# Altium schematic sheet MCU.SchDoc
size B; DrawnBy: Duc Huy Le; SheetNumber: 3; SheetTotal: 4
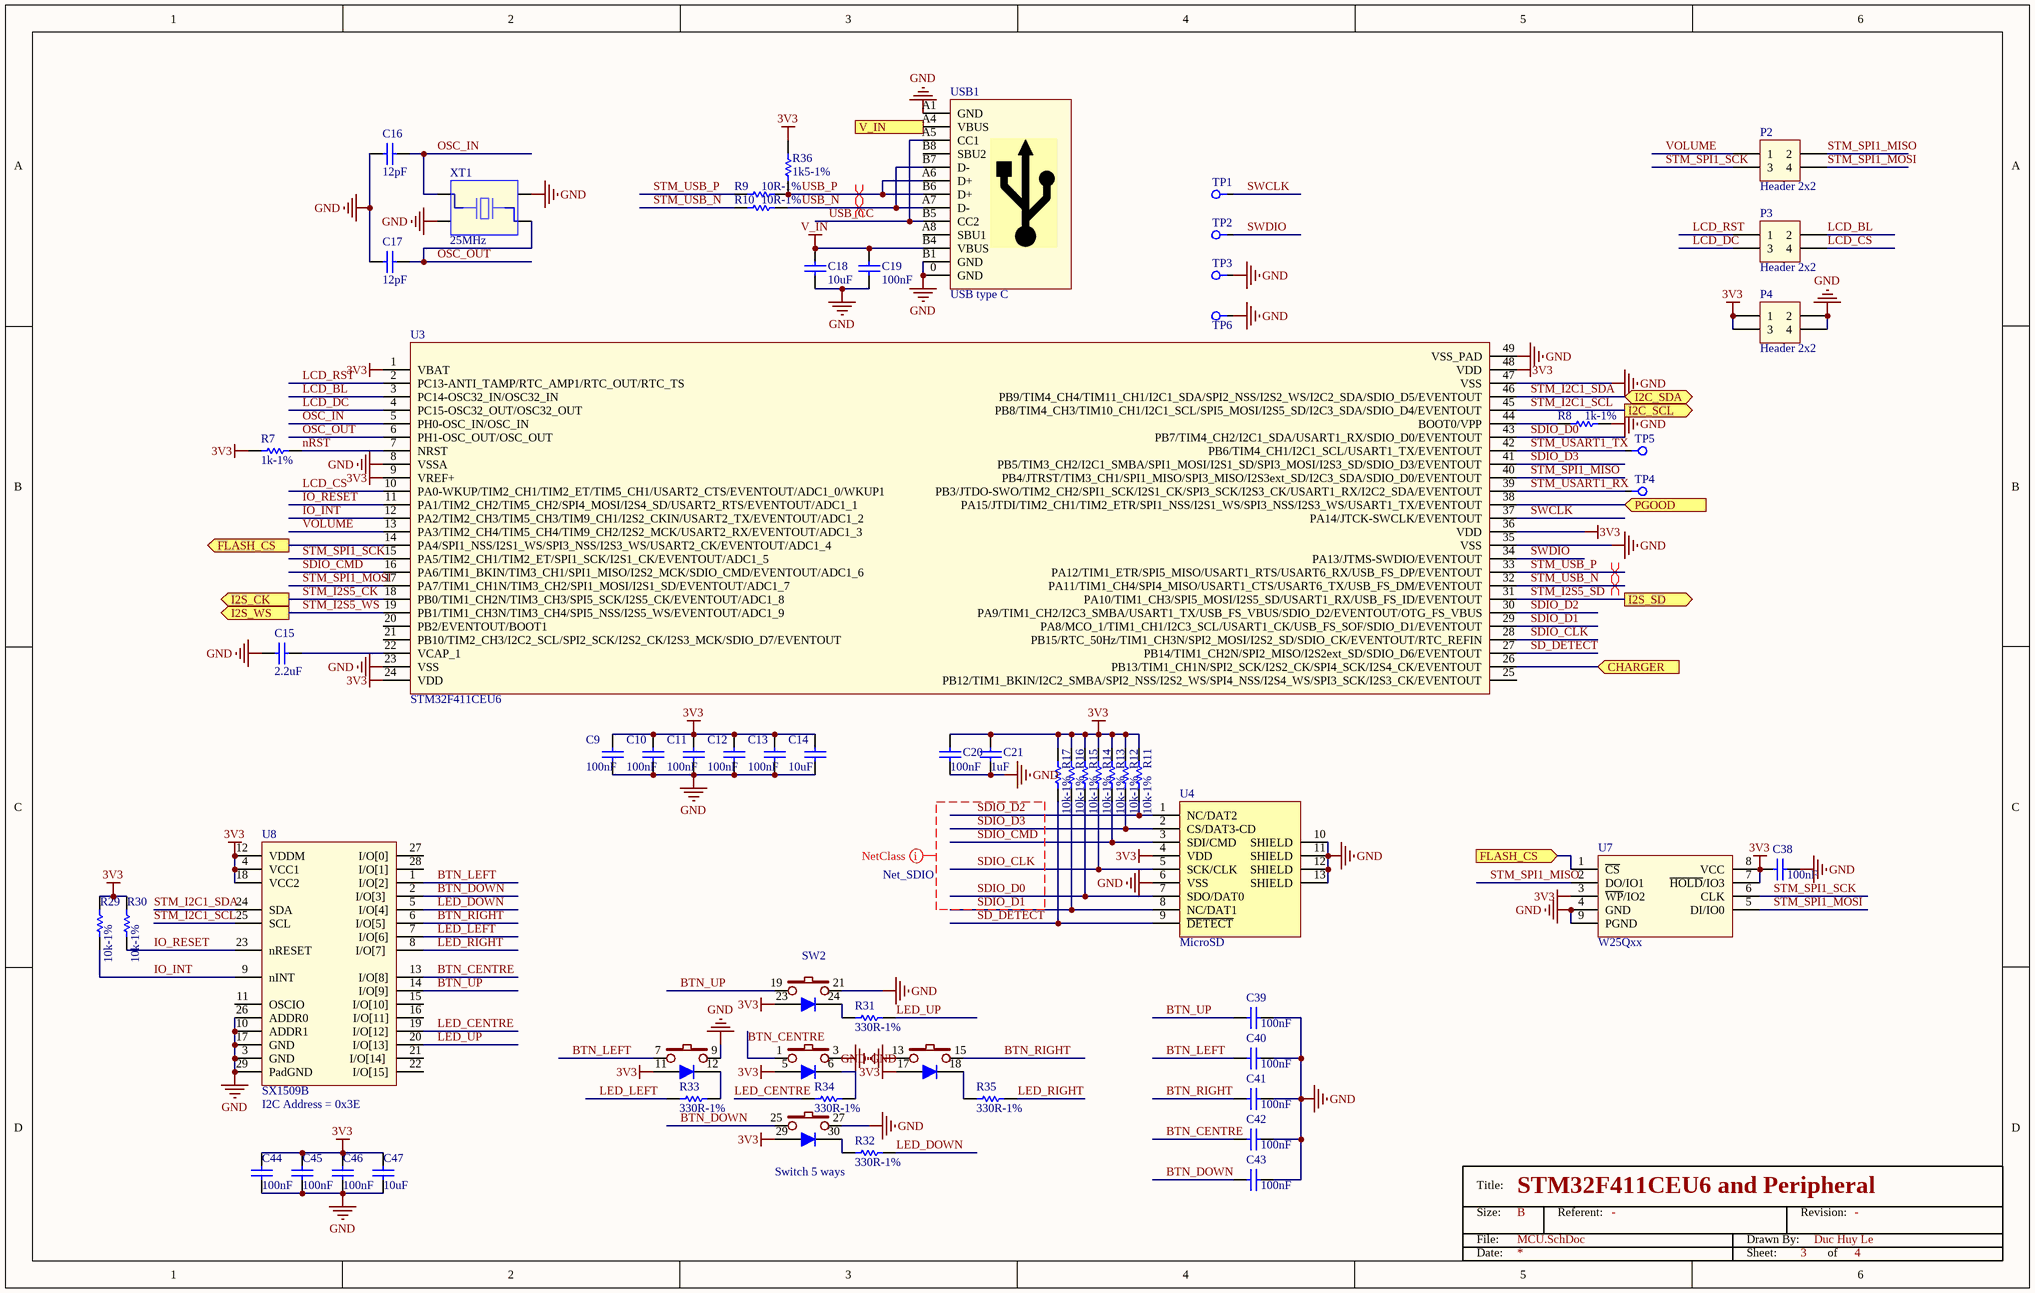
[diagram p0: MCU.SchDoc]

## Parts
C9  100nF  [Cap 0603]
C10  100nF  [Cap 0603]
C11  100nF  [Cap 0603]
C12  100nF  [Cap 0603]
C13  100nF  [Cap 0603]
C14  10uF  [Cap 0603]
C15  2.2uF  [Cap 0603]
C16  12pF  [Cap 0603]
C17  12pF  [Cap 0603]
C18  10uF  [Cap 0603]
C19  100nF  [Cap 0603]
C20  100nF  [Cap 0603]
C21  1uF  [Cap 0603]
C38  100nF  [Cap 0603]
C39  100nF  [Cap 0603]
C40  100nF  [Cap 0603]
C41  100nF  [Cap 0603]
C42  100nF  [Cap 0603]
C43  100nF  [Cap 0603]
C44  100nF  [Cap 0603]
C45  100nF  [Cap 0603]
C46  100nF  [Cap 0603]
C47  10uF  [Cap 0603]
P2  Header 2x2  [Header 2mm 2x2]
P3  Header 2x2  [Header 2mm 2x2]
P4  Header 2x2  [Header 2mm 2x2]
R7  1k-1%  [Res 0603]
R8  1k-1%  [Res 0603]
R9  10R-1%  [Res 0603]
R10  10R-1%  [Res 0603]
R11  10k-1%  [Res 0603]
R12  10k-1%  [Res 0603]
R13  10k-1%  [Res 0603]
R14  10k-1%  [Res 0603]
R15  10k-1%  [Res 0603]
R16  10k-1%  [Res 0603]
R17  10k-1%  [Res 0603]
R29  10k-1%  [Res 0603]
R30  10k-1%  [Res 0603]
R31  330R-1%  [Res 0603]
R32  330R-1%  [Res 0603]
R33  330R-1%  [Res 0603]
R34  330R-1%  [Res 0603]
R35  330R-1%  [Res 0603]
R36  1k5-1%  [Res 0603]
SW2  Switch 5 ways  [Switch 5 ways]
TitleBlock3  Title: STM32F411CEU6 and Peripheral  Size: B  (hidden comment: Title Block)
TP1  TP  [TP]  (value not drawn)
TP2  TP  [TP]  (value not drawn)
TP3  TP  [TP]  (value not drawn)
TP4  TP  [TP]  (value not drawn)
TP5  TP  [TP]  (value not drawn)
TP6  TP  [TP]  (value not drawn)
U3  STM32F411CEU6  [UFQFPN-48]
U4  MicroSD  [MicroSD A]
U7  W25Qxx  [WSON 6x5]
U8  SX1509B  [QFN-28 4x4]
USB1  USB type C  [USB Type C]
XT1  25MHz  [Crystal 3225]

## Ports
CHARGER (in), FLASH_CS (in), FLASH_CS (out), I2C_SCL (out), I2C_SDA (bidir), I2S_CK (out), I2S_SD (out), I2S_WS (out), PGOOD (in), V_IN (out)

## Nets
3V3: C9.2 C10.2 C11.2 C12.2 C13.2 C14.2 C20.1 C21.1 C38.2 C44.2 C45.2 C46.2 C47.2 P4.1 P4.3 R7.2 R11.1 R12.1 R13.1 R14.1 R15.1 R16.1 R17.1 R29.1 R30.1 R36.2 SW2.5(A) SW2.11(A) SW2.17(A) SW2.23(A) SW2.29(A) U3.1(VBAT) U3.9(VREF+) U3.24(VDD) U3.36(VDD) U3.48(VDD) U4.4(VDD) U7.3(~{WP}/IO2) U7.7(~{HOLD}/IO3) U7.8(VCC) U8.4(VCC1) U8.12(VDDM) U8.18(VCC2)
GND: C9.1 C10.1 C11.1 C12.1 C13.1 C14.1 C15.2 C16.2 C17.2 C18.2 C19.2 C20.2 C21.2 C38.1 C39.1 C40.1 C41.1 C42.1 C43.1 C44.1 C45.1 C46.1 C47.1 P4.2 P4.4 R8.1 SW2.3 SW2.9 SW2.13 SW2.21 SW2.27 TP3.1 TP6.1 U3.8(VSSA) U3.23(VSS) U3.35(VSS) U3.47(VSS) U3.49(VSS_PAD) U4.6(VSS) U4.10(SHIELD) U4.11(SHIELD) U4.12(SHIELD) U4.13(SHIELD) U7.4(GND) U7.9(PGND) U8.3(GND) U8.10(ADDR1) U8.17(GND) U8.26(ADDR0) U8.29(PadGND) USB1.0(GND) USB1.A1(GND) USB1.B1(GND) XT1.2 XT1.4
V_IN: C18.1 C19.1 USB1.B4(VBUS)
BTN_CENTRE: C42.2 SW2.1 U8.13(I/O[8])
BTN_DOWN: C43.2 SW2.25 U8.2(I/O[3])
BTN_LEFT: C40.2 SW2.7 U8.1(I/O[2])
BTN_RIGHT: C41.2 SW2.15 U8.6(I/O[5])
BTN_UP: C39.2 SW2.19 U8.14(I/O[9])
CHARGER: U3.26(PB13/TIM1_CH1N/SPI2_SCK/I2S2_CK/SPI4_SCK/I2S4_CK/EVENTOUT) ; port CHARGER
FLASH_CS: U3.14(PA4/SPI1_NSS/I2S1_WS/SPI3_NSS/I2S3_WS/USART2_CK/EVENTOUT/ADC1_4) U7.1(~{CS}) ; port FLASH_CS
IO_INT: R29.2 U3.12(PA2/TIM2_CH3/TIM5_CH3/TIM9_CH1/I2S2_CKIN/USART2_TX/EVENTOUT/ADC1_2) U8.9(nINT)
IO_RESET: R30.2 U3.11(PA1/TIM2_CH2/TIM5_CH2/SPI4_MOSI/I2S4_SD/USART2_RTS/EVENTOUT/ADC1_1) U8.23(nRESET)
LCD_BL: P3.2 U3.3(PC14-OSC32_IN/OSC32_IN)
LCD_CS: P3.4 U3.10(PA0-WKUP/TIM2_CH1/TIM2_ET/TIM5_CH1/USART2_CTS/EVENTOUT/ADC1_0/WKUP1)
LCD_DC: P3.3 U3.4(PC15-OSC32_OUT/OSC32_OUT)
LCD_RST: P3.1 U3.2(PC13-ANTI_TAMP/RTC_AMP1/RTC_OUT/RTC_TS)
LED_CENTRE: R34.1 U8.19(I/O[12])
LED_DOWN: R32.2 U8.5(I/O[4])
LED_LEFT: R33.1 U8.7(I/O[6])
LED_RIGHT: R35.2 U8.8(I/O[7])
LED_UP: R31.2 U8.20(I/O[13])
nRST: R7.1 U3.7(NRST)
OSC_IN: C16.1 U3.5(PH0-OSC_IN/OSC_IN) XT1.1
OSC_OUT: C17.1 U3.6(PH1-OSC_OUT/OSC_OUT) XT1.3
PGOOD: U3.38(PA15/JTDI/TIM2_CH1/TIM2_ETR/SPI1_NSS/I2S1_WS/SPI3_NSS/I2S3_WS/USART1_TX/EVENTOUT) ; port PGOOD
SD_DETECT: R17.2 U3.27(PB14/TIM1_CH2N/SPI2_MISO/I2S2ext_SD/SDIO_D6/EVENTOUT) U4.9(~{DETECT})
SDIO_CLK: R14.2 U3.28(PB15/RTC_50Hz/TIM1_CH3N/SPI2_MOSI/I2S2_SD/SDIO_CK/EVENTOUT/RTC_REFIN) U4.5(SCK/CLK)
SDIO_CMD: R13.2 U3.16(PA6/TIM1_BKIN/TIM3_CH1/SPI1_MISO/I2S2_MCK/SDIO_CMD/EVENTOUT/ADC1_6) U4.3(SDI/CMD)
SDIO_D0: R15.2 U3.43(PB7/TIM4_CH2/I2C1_SDA/USART1_RX/SDIO_D0/EVENTOUT) U4.7(SDO/DAT0)
SDIO_D1: R16.2 U3.29(PA8/MCO_1/TIM1_CH1/I2C3_SCL/USART1_CK/USB_FS_SOF/SDIO_D1/EVENTOUT) U4.8(NC/DAT1)
SDIO_D2: R11.2 U3.30(PA9/TIM1_CH2/I2C3_SMBA/USART1_TX/USB_FS_VBUS/SDIO_D2/EVENTOUT/OTG_FS_VBUS) U4.1(NC/DAT2)
SDIO_D3: R12.2 U3.41(PB5/TIM3_CH2/I2C1_SMBA/SPI1_MOSI/I2S1_SD/SPI3_MOSI/I2S3_SD/SDIO_D3/EVENTOUT) U4.2(CS/DAT3-CD)
STM_I2C1_SCL: U3.45(PB8/TIM4_CH3/TIM10_CH1/I2C1_SCL/SPI5_MOSI/I2S5_SD/I2C3_SDA/SDIO_D4/EVENTOUT) U8.25(SCL) ; port I2C_SCL
STM_I2C1_SDA: U3.46(PB9/TIM4_CH4/TIM11_CH1/I2C1_SDA/SPI2_NSS/I2S2_WS/I2C2_SDA/SDIO_D5/EVENTOUT) U8.24(SDA) ; port I2C_SDA
STM_I2S5_CK: U3.18(PB0/TIM1_CH2N/TIM3_CH3/SPI5_SCK/I2S5_CK/EVENTOUT/ADC1_8) ; port I2S_CK
STM_I2S5_SD: U3.31(PA10/TIM1_CH3/SPI5_MOSI/I2S5_SD/USART1_RX/USB_FS_ID/EVENTOUT) ; port I2S_SD
STM_I2S5_WS: U3.19(PB1/TIM1_CH3N/TIM3_CH4/SPI5_NSS/I2S5_WS/EVENTOUT/ADC1_9) ; port I2S_WS
STM_SPI1_MISO: P2.2 U3.40(PB4/JTRST/TIM3_CH1/SPI1_MISO/SPI3_MISO/I2S3ext_SD/I2C3_SDA/SDIO_D0/EVENTOUT) U7.2(DO/IO1)
STM_SPI1_MOSI: P2.4 U3.17(PA7/TIM1_CH1N/TIM3_CH2/SPI1_MOSI/I2S1_SD/EVENTOUT/ADC1_7) U7.5(DI/IO0)
STM_SPI1_SCK: P2.3 U3.15(PA5/TIM2_CH1/TIM2_ET/SPI1_SCK/I2S1_CK/EVENTOUT/ADC1_5) U7.6(CLK)
STM_USART1_RX: TP4.1 U3.39(PB3/JTDO-SWO/TIM2_CH2/SPI1_SCK/I2S1_CK/SPI3_SCK/I2S3_CK/USART1_RX/I2C2_SDA/EVENTOUT)
STM_USART1_TX: TP5.1 U3.42(PB6/TIM4_CH1/I2C1_SCL/USART1_TX/EVENTOUT)
STM_USB_N: R10.2 U3.32(PA11/TIM1_CH4/SPI4_MISO/USART1_CTS/USART6_TX/USB_FS_DM/EVENTOUT)
STM_USB_P: R9.2 U3.33(PA12/TIM1_ETR/SPI5_MISO/USART1_RTS/USART6_RX/USB_FS_DP/EVENTOUT)
SWCLK: TP1.1 U3.37(PA14/JTCK-SWCLK/EVENTOUT)
SWDIO: TP2.1 U3.34(PA13/JTMS-SWDIO/EVENTOUT)
USB_CC: USB1.A5(CC1) USB1.B5(CC2)
USB_N: R10.1 USB1.A7(D-) USB1.B7(D-)
USB_P: R9.1 R36.1 USB1.A6(D+) USB1.B6(D+)
V_IN: USB1.A4(VBUS) ; port V_IN  [a separate net that carries the same name]
VOLUME: P2.1 U3.13(PA3/TIM2_CH4/TIM5_CH4/TIM9_CH2/I2S2_MCK/USART2_RX/EVENTOUT/ADC1_3)
NetC15_1: C15.1 U3.22(VCAP_1)
NetR8_2: R8.2 U3.44(BOOT0/VPP)
NetR31_1: R31.1 SW2.24(K)
NetR32_1: R32.1 SW2.30(K)
NetR33_2: R33.2 SW2.12(K)
NetR34_2: R34.2 SW2.6(K)
NetR35_1: R35.1 SW2.18(K)

Not connected (* = marked no-connect by the designer): U3 20(PB2/EVENTOUT/BOOT1) 21(PB10/TIM2_CH3/I2C2_SCL/SPI2_SCK/I2S2_CK/I2S3_MCK/SDIO_D7/EVENTOUT) 25(PB12/TIM1_BKIN/I2C2_SMBA/SPI2_NSS/I2S2_WS/SPI4_NSS/I2S4_WS/SPI3_SCK/I2S3_CK/EVENTOUT); U8 11(OSCIO) 15(I/O[10]) 16(I/O[11]) 21(I/O[14]_) 22(I/O[15]) 27(I/O[0]) 28(I/O[1]); USB1 A8(SBU1) B8(SBU2)

## Layout directives
differential pair; differential pair class Diff_USB: STM_USB_N, STM_USB_P
differential pair: USB_N, USB_P
net class Net_SDIO: SDIO_CLK, SDIO_CMD, SDIO_D0, SDIO_D1, SDIO_D2, SDIO_D3

## Notes on the sheet
- (near U8) I2C Address = 0x3E
- (in symbol Title Block) Title:; Size:; Referent:; Revision:; File:; Drawn By:; Date:; Sheet:; of

## Library data of the parts
C9-C21 C38-C47 = Cap: Cap SMD
R7-R17 R29-R36 = Res: Res SMD
SW2 = Switch 5 ways: Switch 5 ways: left, right, up, down, centre; pin to pad: 1>1+2 3>3+4 7>7+8 9>9+10 13>13+14 15>15+16 19>19+20 21>21+22 25>25+26 27>27+28
U3 = STM32F411CEU6: UFQFPN48 Arm® Cortex®-M4 32b MCU+FPU, 125 DMIPS, 512KB Flash, / 128KB RAM, USB OTG FS, 11 TIMs, 1 ADC, 13 comm. interfaces
U4 = MicroSD-A: MicroSD Push-Push A
U7 = W25Qxx: Flash Memory SPI Interface
U8 = SX1509B: SX1509B 16-channel I2C GPIO with LED Driver and Keypad Engine
USB1 = USB type C: USB type C 16 Pins
XT1 = XT4: Xtal 4 pins SMD
TitleBlock3 = Title Block: Revision: -; Referent: -